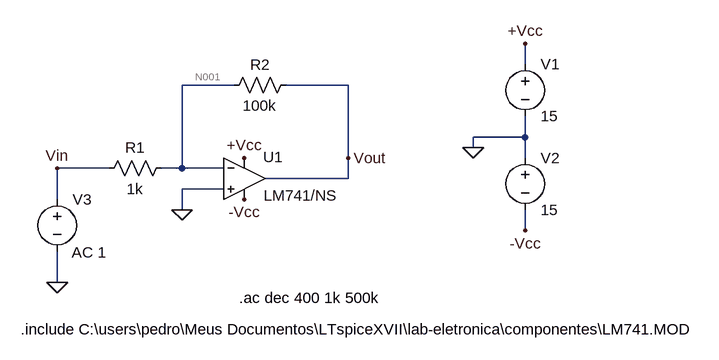
[diagram p0: schematic circuito3.asc]
circuito3.asc, the LTspice schematic file:
Version 4
SHEET 1 1292 680
WIRE 912 -240 912 -272
WIRE 464 -208 384 -208
WIRE 640 -208 544 -208
WIRE 912 -128 912 -160
WIRE 912 -128 832 -128
WIRE 832 -112 832 -128
WIRE 640 -96 640 -208
WIRE 912 -96 912 -128
WIRE 272 -80 192 -80
WIRE 384 -80 384 -208
WIRE 384 -80 352 -80
WIRE 448 -80 384 -80
WIRE 640 -64 640 -96
WIRE 640 -64 512 -64
WIRE 448 -48 384 -48
WIRE 192 -32 192 -80
WIRE 384 -16 384 -48
WIRE 912 16 912 -16
WIRE 192 96 192 48
FLAG 832 -112 0
FLAG 912 -272 +Vcc
FLAG 912 16 -Vcc
FLAG 480 -96 +Vcc
FLAG 480 -32 -Vcc
FLAG 384 -16 0
FLAG 192 -80 Vin
FLAG 640 -96 Vout
FLAG 192 96 0
SYMBOL OpAmps\\opamp2 480 -128 R0
WINDOW 0 29 31 Left 2
WINDOW 3 30 90 Left 2
SYMATTR InstName U1
SYMATTR Value LM741/NS
SYMBOL voltage 912 -256 R0
WINDOW 123 0 0 Left 0
WINDOW 39 0 0 Left 0
SYMATTR InstName V1
SYMATTR Value 15
SYMBOL voltage 912 -112 R0
WINDOW 123 0 0 Left 0
WINDOW 39 0 0 Left 0
SYMATTR InstName V2
SYMATTR Value 15
SYMBOL voltage 192 -48 R0
WINDOW 3 36 92 Left 2
WINDOW 123 22 98 Left 2
WINDOW 39 0 0 Left 0
SYMATTR Value ""
SYMATTR Value2 AC 1
SYMATTR InstName V3
SYMBOL res 368 -96 R90
WINDOW 0 0 56 VBottom 2
WINDOW 3 32 56 VTop 2
SYMATTR InstName R1
SYMATTR Value 1k
SYMBOL res 560 -224 R90
WINDOW 0 0 56 VBottom 2
WINDOW 3 32 56 VTop 2
SYMATTR InstName R2
SYMATTR Value 100k
TEXT 136 168 Left 2 !.include C:\\users\\pedro\\Meus Documentos\\LTspiceXVII\\lab-eletronica\\componentes\\LM741.MOD
TEXT 472 120 Left 2 !.ac dec 400 1k 500k

The netlist it stands for:
* circuito3.asc
XU1 0 N001 +Vcc -Vcc Vout LM741/NS  ; pins In+ In- V+ V- OUT
V1 +Vcc 0 15
V2 0 -Vcc 15
V3 Vin 0 AC 1
R1 N001 Vin 1k
R2 Vout N001 100k
.include C:\users\pedro\Meus Documentos\LTspiceXVII\lab-eletronica\componentes\LM741.MOD
.ac dec 400 1k 500k
.backanno
.end

* Results of the author's LTspice run, read from the files saved beside the schematic
* Operating Point, zero values left out:
*   V(n001) = 999.5 µV
*   V(-vcc) = -15 V
*   V(+vcc) = 15 V
*   V(vout) = 111.1 mV
*   I(R2) = 1.101 µA
*   I(R1) = 999.5 nA
*   I(V3) = 999.5 nA
*   I(V2) = -1.701 mA
*   I(V1) = -1.702 mA
*   Ix(u1:1) = 57.86 nA
*   Ix(u1:2) = 101.9 nA
*   Ix(u1:99) = 1.702 mA
*   Ix(u1:50) = -1.701 mA
*   Ix(u1:28) = -1.101 µA
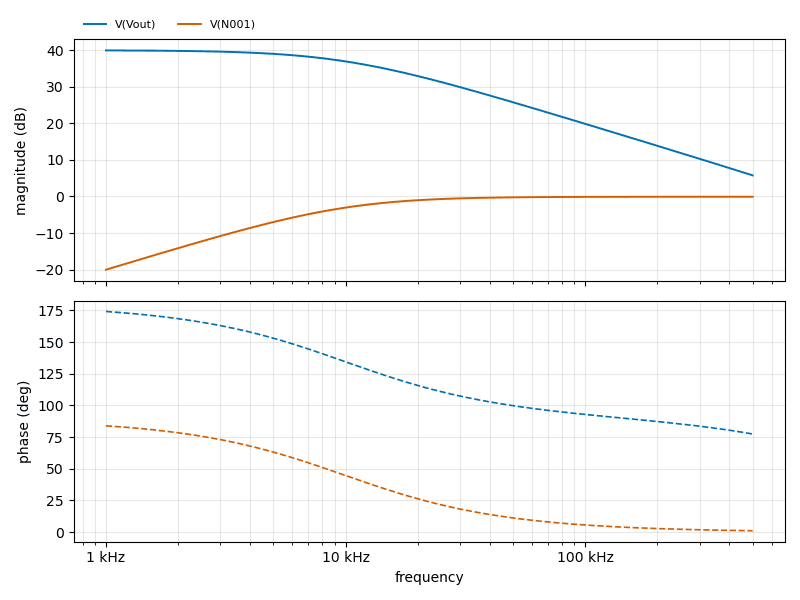
[diagram p1: AC Analysis of circuito3.asc, plotted from the saved traces]
* AC Analysis, 1 run:
*   V(Vout): 39.95 dB at 1 kHz, 5.77 dB at 500 kHz, peak 39.95 dB at 1 kHz, 3 dB below the peak at 10.01 kHz
*   V(N001): -20.04 dB at 1 kHz, -0.08 dB at 500 kHz, peak -0.08 dB at 500 kHz, 3 dB below the peak at 9.898 kHz